# Altium schematic sheet Data_Conversion.SchDoc
size A; DocumentNumber: 4; SheetNumber: 4; SheetTotal: 5
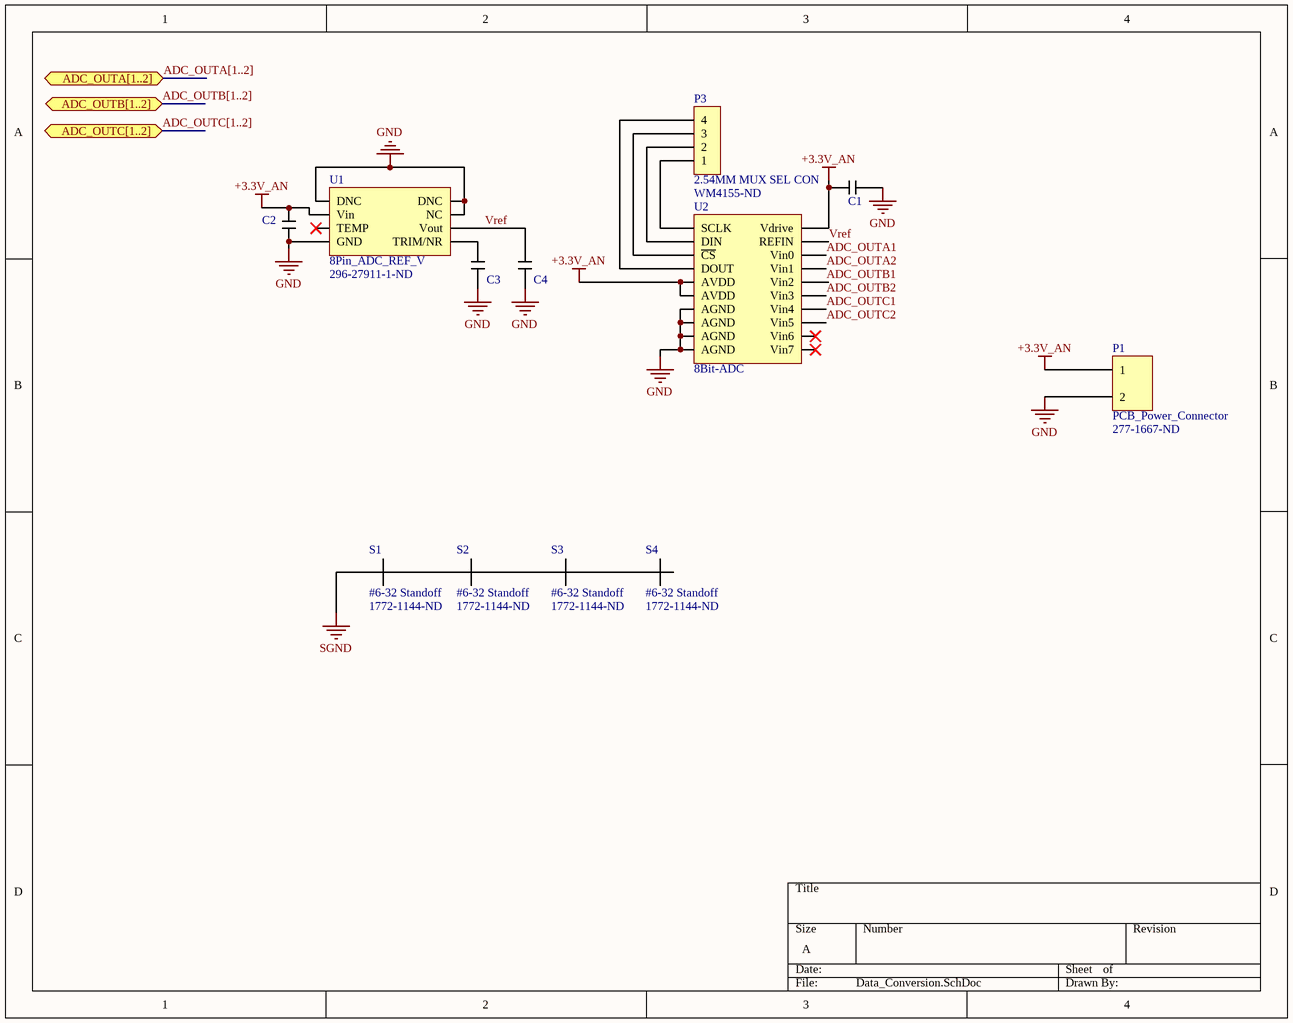
[diagram p0: Data_Conversion.SchDoc]

## Parts
C1  0.1uF Cap  [0.1uF_Kemet]  (value not drawn)
C2  0.1uF Cap  [0.1uF_Kemet]  (value not drawn)
C3  0.1uF Cap  [0.1uF_Kemet]  (value not drawn)
C4  0.1uF Cap  [0.1uF_Kemet]  (value not drawn)
P1  PCB_Power_Connector  Supplier Part Number 1: 277-1667-ND  [Power_Connector]
P3  2.54MM MUX SEL CON  Supplier Part Number 1: WM4155-ND  [4POS 2.54MM HEADER MUX SEL]
S1  #6-32 Standoff  Supplier Part Number 1: 1772-1144-ND  [#6-32 Stand Off]
S2  #6-32 Standoff  Supplier Part Number 1: 1772-1144-ND  [#6-32 Stand Off]
S3  #6-32 Standoff  Supplier Part Number 1: 1772-1144-ND  [#6-32 Stand Off]
S4  #6-32 Standoff  Supplier Part Number 1: 1772-1144-ND  [#6-32 Stand Off]
U1  8Pin_ADC_REF_V  Supplier Part Number 1: 296-27911-1-ND  [SOIC127P600X175-8N]
U2  8Bit-ADC  [8Bit-8Ch-SAR-ADC]

## Ports
ADC_OUTA[1..2] (bidir), ADC_OUTB[1..2] (bidir), ADC_OUTC[1..2] (bidir)

## Nets
+3.3V_AN: C1.2 C2.2 P1.1 U1.2(Vin) U2.5(AVDD) U2.6(AVDD) U2.19(Vdrive)
GND: C1.1 C2.1 C3.2 C4.1 P1.2 U1.1(DNC) U1.4(GND) U1.7(NC) U1.8(DNC) U2.4(AGND) U2.8(AGND) U2.17(AGND) U2.20(AGND)
ADC_OUTA1: U2.16(Vin0)
ADC_OUTA2: U2.15(Vin1)
ADC_OUTB1: U2.14(Vin2)
ADC_OUTB2: U2.13(Vin3)
ADC_OUTC1: U2.12(Vin4)
ADC_OUTC2: U2.11(Vin5)
Vref: C4.2 U1.6(Vout) U2.7(REFIN)
NetC3_1: C3.1 U1.5(TRIM/NR)
NetP3_1: P3.1 U2.1(SCLK)
NetP3_2: P3.2 U2.2(DIN)
NetP3_3: P3.3 U2.3(~{CS})
NetP3_4: P3.4 U2.18(DOUT)

Not connected (* = marked no-connect by the designer): U1 3(TEMP)*; U2 9(Vin7)* 10(Vin6)*

## Buses and harness runs
bus ADC_OUTA[1..2] = port ADC_OUTA[1..2]
bus ADC_OUTB[1..2] = port ADC_OUTB[1..2]
bus ADC_OUTC[1..2] = port ADC_OUTC[1..2]

## Library data of the parts
C1-C4 = 0.1uF Cap: C0603C101K8GAC7867 Kemet Capacitor; Supplier 1: Digi-Key; Supplier Part Number 1: 399-14477-1-ND
P1 = PCB_Power_Connector: Manufacturer: Phoenix Contact; Manufacturer Part Number: PT1,5/2-5.0-H; Max Current Rating: 16A; Max Supply Voltage: 250V; Current Rating: 17.5A; Number of Poles: 2; Number of Levels: 1; Current: 18A; Voltage: 300V; Voltage Rating (DC): 320V; Connector Type: Screw; Wire Gauge (Max): 26AWG; Wire Gauge (Min): 12AWG; Pitch: 5mm; Wire/Cable Gauge: 14AWG; Approvals: UL; Supplier 1: Digi-Key; Stock 1: 104404; Pricing 1: 1=0.43, 10=0.411, 50=0.3928, 100=0.382, 250=0.357, 500=0.3284, 1000=0.3035 (USD); Mount: Through Hole; Number of Pins: 2; Weight: 0.067021oz; Color: Green; Material: Nylon; Housing Color: Green; Housing Material: Polyamide; Insulation Material: Nylon; Contact Material: Copper,Tin; Number of Rows: 1; Voltage Rating: 250V; Package Quantity: 250; Packaging: Bulk; Number of Positions: 2; Number of Positions Per Level: 2; Termination: Solder; Number of Contacts: 2; Number of Circuits: 2; Orientation: Straight; Length: 9mm; Height: 11.3mm; Width: 14.9mm; Depth: 9mm; Radiation Hardening: No; Lead Free: Lead Free; Flammability Rating: UL94 V-0; ComponentLink1URL: https://media.digikey.com/pdf/Data%20Sheets/Phoenix%20Contact%20PDFs/1935161.pdf; ComponentLink1Description: https://media.digikey.com/pdf/Data%20Sheets/Phoenix%20Contact%20PDFs/1935161.pdf; ComponentLink2URL: https://www.verical.com/server-webapp/html/getDatasheet?partID=177903; ComponentLink2Description: https://www.verical.com/server-webapp/html/getDatasheet?partID=177903
P3 = 2.54MM MUX SEL CON: Manufacturer: Molex; Manufacturer Part Number: 0705530108; Contact Resistance: 30mR; Number of Positions: 4; Connector Type: Male Pin; Pitch: 0.1inch; Voltage Rating: 250V; Current Rating: 3A; Gender: Male; Insulation Resistance: 1GR; Glow Wire Compliant: Non-compliant; Supplier 1: Digi-Key; Stock 1: 1281; Mount: Through Hole; Contact Plating: Gold; Contact Material: Bronze; Housing Material: Polyester; Color: Black; Housing Color: Black; Min Operating Temperature: -40°C; Max Operating Temperature: 105°C; Number of Rows: 1; Packaging: Rail/Tube; Termination: Solder; Orientation: Right Angle; Fastening Type: Latch; Length: 12.71mm; Contact Mating Length: 0.24inch; Depth: 13.59mm; Radiation Hardening: No; ComponentLink1URL: https://www.molex.com/pdm_docs/ps/PS-70400.pdf?src-supplier=Digi-Key; ComponentLink1Description: https://www.molex.com/pdm_docs/ps/PS-70400.pdf?src-supplier=Digi-Key; ComponentLink2URL: http://www.molex.com/webdocs/datasheets/pdf/en-us/0705530108_PCB_HEADERS.pdf?src-supplier=Avnet+Asia; ComponentLink2Description: http://www.molex.com/webdocs/datasheets/pdf/en-us/0705530108_PCB_HEADERS.pdf?src-supplier=Avnet+Asia; Pricing 1: 1=2.03, 10=1.838, 100=1.575, 500=1.3125, 1680=1.0875, 5040=0.9975, 10080=0.975 (USD); Material: Brass; Package Quantity: 1680; Number of Contacts: 4; Voltage Rating (DC): 250V; Number of Circuits: 4; REACH SVHC: Unknown; ELV: Compliant; Flammability Rating: UL94 V-0; ComponentLink3URL: http://www.farnell.com/datasheets/2027073.pdf?src-supplier=Element14; ComponentLink3Description: http://www.farnell.com/datasheets/2027073.pdf?src-supplier=Element14; ComponentLink4URL: http://www.molex.com/webdocs/datasheets/pdf/en-us/0705530108_PCB_HEADERS.pdf?src-supplier=Avnet; ComponentLink4Description: http://www.molex.com/webdocs/datasheets/pdf/en-us/0705530108_PCB_HEADERS.pdf?src-supplier=Avnet; ComponentLink5URL: http://www.mouser.com/ds/2/276/0705530108_PCB_HEADERS-172949.pdf?src-supplier=Mouser; ComponentLink5Description: http://www.mouser.com/ds/2/276/0705530108_PCB_HEADERS-172949.pdf?src-supplier=Mouser
S1-S4 = #6-32 Standoff: Manufacturer: RAF; Manufacturer Part Number: 2102T-632-AL-7; Supplier 1: Digi-Key; Stock 1: 1687; Pricing 1: 1=0.5, 25=0.3328, 100=0.2834, 250=0.2692, 500=0.2551, 1000=0.2409 (USD); Package Quantity: 100
U1 = 8Pin_ADC_REF_V: Manufacturer: Texas Instruments; Manufacturer Part Number: REF5025AQDRQ1; Max Input Voltage: 18V; Output Voltage: 2.5V; Min Input Voltage: 2.7V; Nominal Supply Current: 800uA; Tolerance: 0.1%; Max Output Current: 10mA; Operating Supply Current: 1.2mA; Temperature Coefficient: 3ppm/°C; Reference Type: Series; Output Type: Fixed; Number of Channels: 1; Description: IC VREF SERIES 3V 8SOIC; Case/Package: D; Number of Pins: 8; Weight: 0.002677oz; Min Operating Temperature: -40°C; Max Operating Temperature: 125°C; Packaging: Tape and Reel; Package Quantity: 1; Min Output Voltage: 2.5V; Output Current: 10mA; Max Output Voltage: 2.5V; Quiescent Current: 800uA; Radiation Hardening: No; Lead Free: Lead Free; ComponentLink1URL: http://www.ti.com/lit/ds/symlink/ref5025a-q1.pdf; ComponentLink1Description: http://www.ti.com/lit/ds/symlink/ref5025a-q1.pdf; Supplier 1: Digi-Key; Stock 1: 16802; Pricing 1: 1=3.54, 10=3.182, 100=2.607, 500=2.2193, 1000=1.8717 (USD); ComponentLink2URL: http://www.ti.com/lit/ds/symlink/ref5020a-q1.pdf?src-supplier=Digi-Key; ComponentLink2Description: http://www.ti.com/lit/ds/symlink/ref5020a-q1.pdf?src-supplier=Digi-Key; ComponentLink3URL: http://www.ti.com/lit/ds/symlink/ref5030a-q1.pdf?src-supplier=Digi-Key; ComponentLink3Description: http://www.ti.com/lit/ds/symlink/ref5030a-q1.pdf?src-supplier=Digi-Key
U2 = 8Bit-8Ch-SAR-ADC: Manufacturer: Analog Devices; Manufacturer Part Number: AD7908WYRUZ-REEL7; Max Power Dissipation: 13.5mW; Number of Channels: 8; Interface: SPI; Sampling Rate: 1MS/s; Number of A/D Converters: 1; Resolution: 8b; Signal to Noise Ratio (SNR): 49dB; Input Capacitance: 20pF; Max Input Voltage: 2.525V; Min Input Voltage: 2.475V; Supplier 1: Digi-Key; Stock 1: 1000; Pricing 1: 1=5.68, 10=5.1, 100=4.1789 (USD); Case/Package: TSSOP; Number of Pins: 20; Min Operating Temperature: -40°C; Max Operating Temperature: 85°C; Package Quantity: 1000; Packaging: Tape and Reel; Number of Bits: 8; Number of Inputs: 8; Power Dissipation: 13.5mW; Radiation Hardening: No; Lead Free: Contains Lead; ComponentLink1URL: http://www.analog.com/media/en/technical-documentation/data-sheets/AD7908_7918_7928.pdf?src-supplier=Digi-Key; ComponentLink1Description: http://www.analog.com/media/en/technical-documentation/data-sheets/AD7908_7918_7928.pdf?src-supplier=Digi-Key; ComponentLink2URL: http://www.produktinfo.conrad.com/datenblaetter/1200000-1299999/001245580-da-01-en-IC_ADC_8B_AD7908WYRUZ_REEL7_TSSOP_20_ADI.pdf?src-supplier=Conrad; ComponentLink2Description: http://www.produktinfo.conrad.com/datenblaetter/1200000-1299999/001245580-da-01-en-IC_ADC_8B_AD7908WYRUZ_REEL7_TSSOP_20_ADI.pdf?src-supplier=Conrad; Supplier Part Number 1: AD7908WYRUZ-REEL7CT-ND